# Altium project LimeNet-Micro_2v1-SDR.PrjPcb (part 9 of 10)
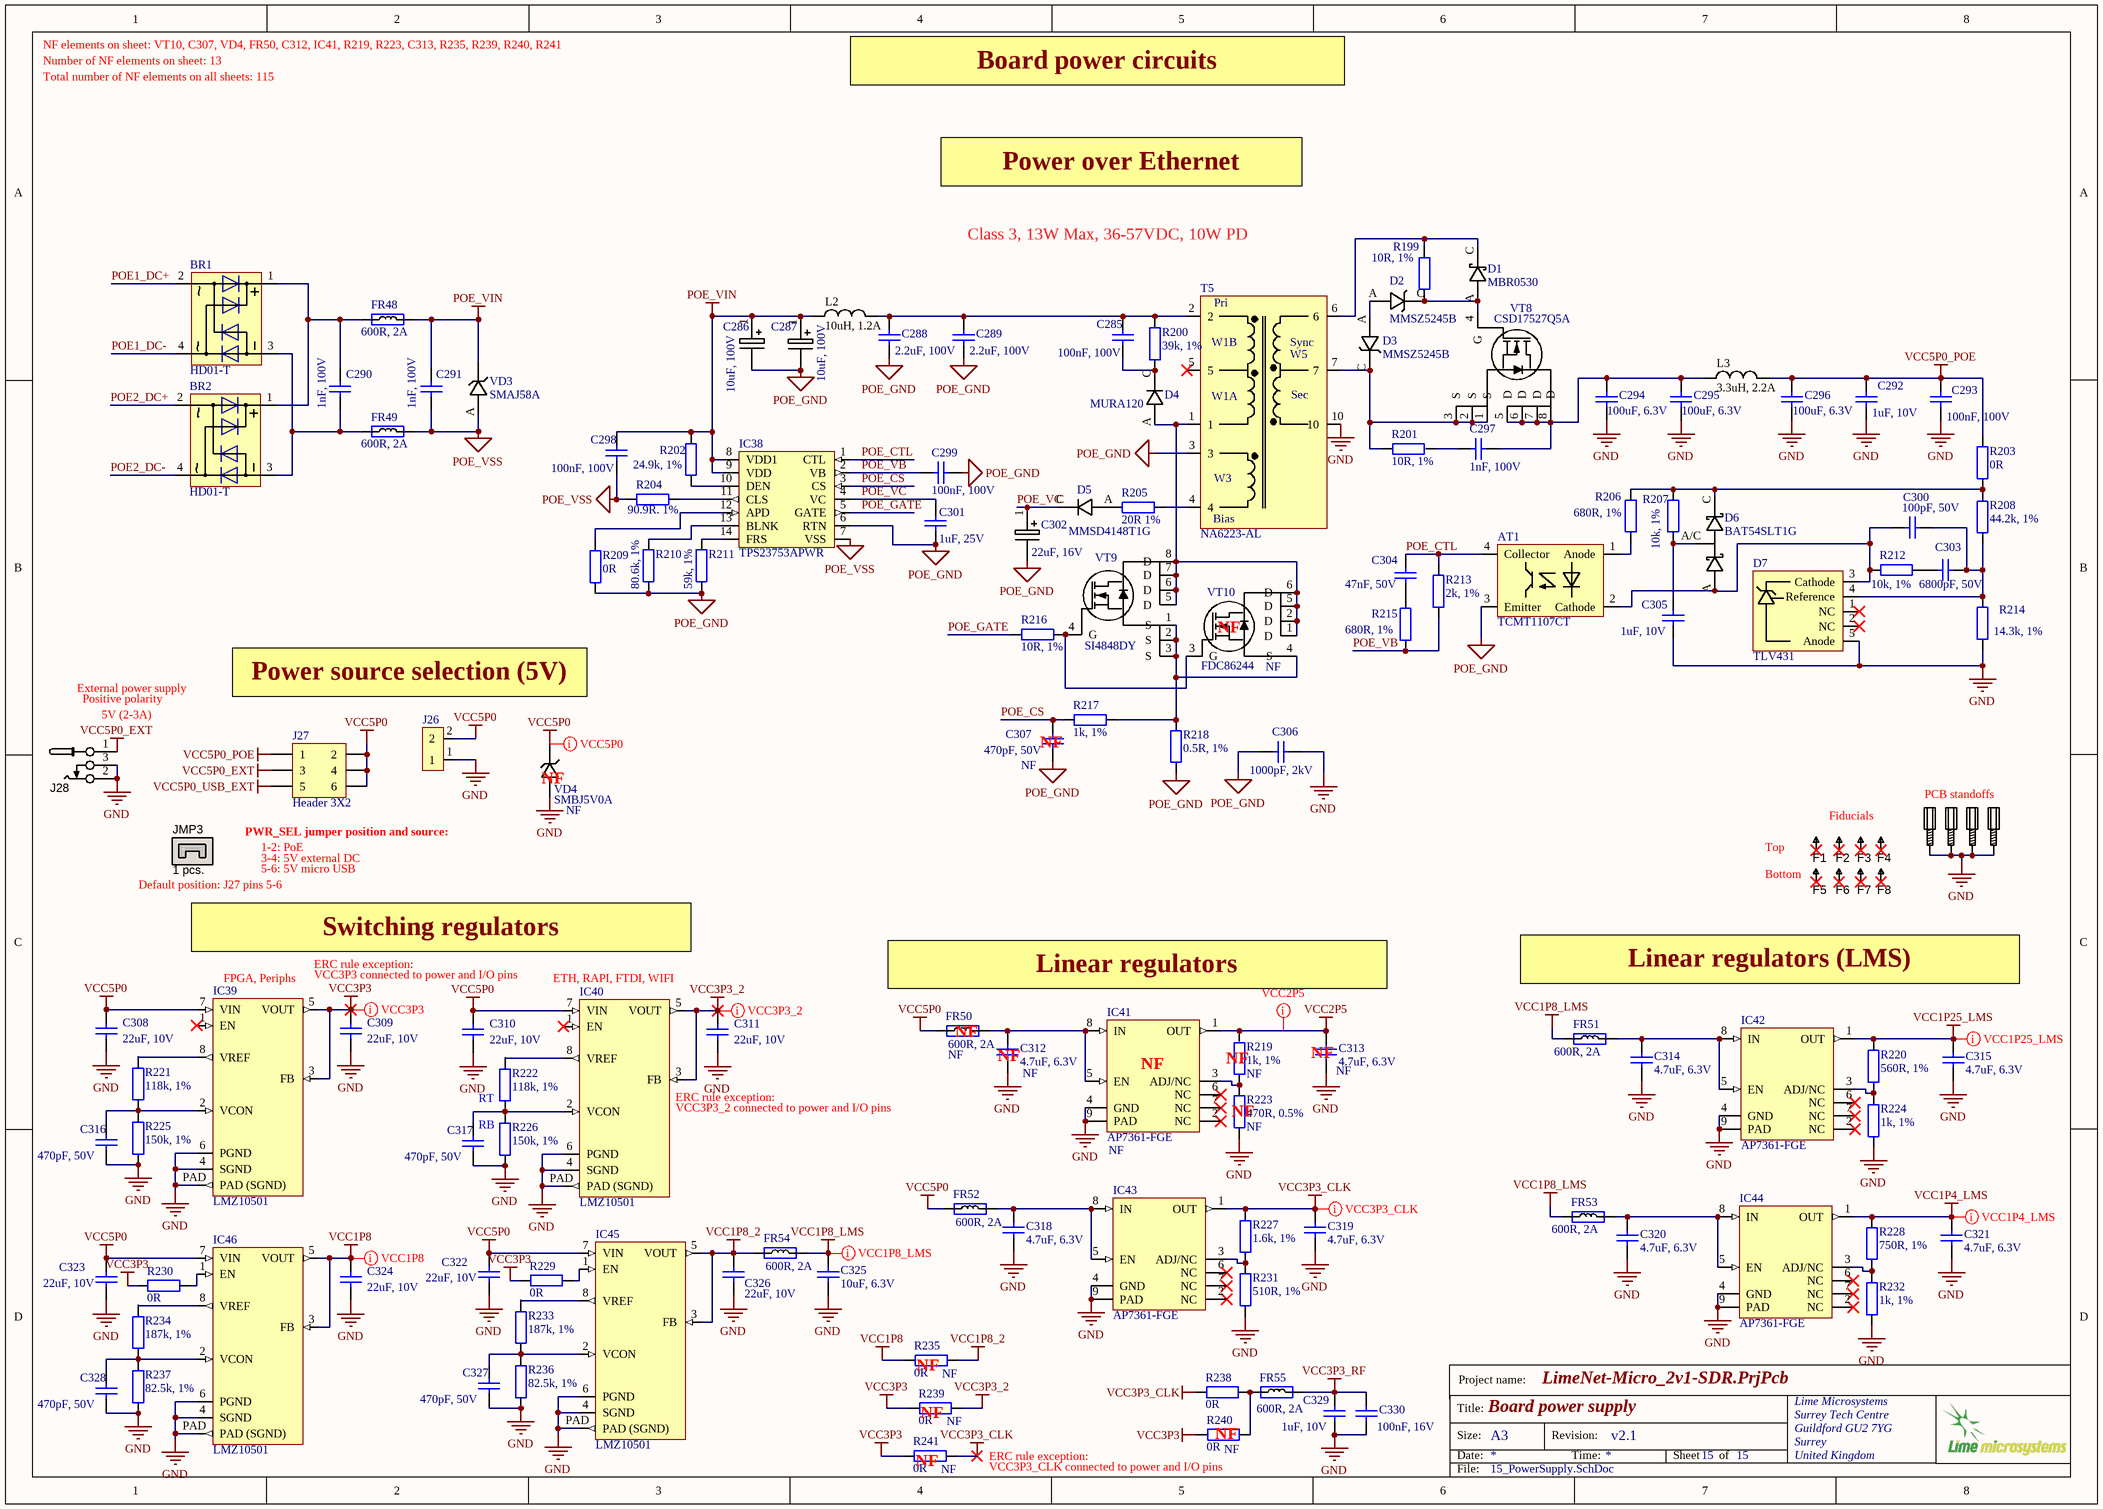
[diagram p16: 15_PowerSupply.SchDoc]

## Sheet 15_PowerSupply.SchDoc: Board power supply (continued)

### Library data of the parts (continued)
L3 = Inductor_0603: Part Description: 3.3µH Semi-Shielded Wirewound Inductor 2.2A 66 mOhm Max Nonstandard; Manufacturer: Bourns; Manufacturer Part Number 1: SRN4018-3R3M; Core Material: Ferrite; Material: Steel; Tolerance: 20%; Saturation Current: 2.3A; Shielding: Shielded; DC Resistance (DCR): 66mR; Self Resonant Frequency: 45MHz; Test Frequency: 100kHz; Value: 3.3uH, 2.2A; ComponentLink1URL: https://www.yuden.co.jp/productdata/catalog/en/wound04_e.pdf; ComponentLink1Description: https://www.yuden.co.jp/productdata/catalog/en/wound04_e.pdf; ComponentLink2URL: http://uk.rs-online.com/webdocs/10b3/0900766b810b3cd2.pdf; ComponentLink2Description: http://uk.rs-online.com/webdocs/10b3/0900766b810b3cd2.pdf; Supplier 1: Digi-Key; Supplier Part Number 1: SRN4018-3R3MCT-ND; Stock 1: 14181; Pricing 1: 1=0.46, 10=0.403, 100=0.2875, 500=0.2415, 1000=0.1955 (USD); Mount: Surface Mount; Case/Package: Nonstandard; Number of Pins: 2; Min Operating Temperature: -25°C; Max Operating Temperature: 120°C; Packaging: Cut Tape; Package Quantity: 3000; Current Rating: 2.2A; Inductance: 3.3uh; Inductance Tolerance: 20%; Composition: Wirewound; Max DC Current: 2.2A; Termination: SMD/SMT; DC Current: 2.2A; Military Standard: Not; RMS Current (Irms): 2.2A; Length: 4mm; Height: 1.8mm; Width: 4mm; Height - Seated (Max): 0.071inch; Depth: 4.2mm; REACH SVHC: No SVHC; ComponentLink3URL: http://www.bourns.com/docs/Product-Datasheets/SRN4018.pdf; ComponentLink3Description: http://www.bourns.com/docs/Product-Datasheets/SRN4018.pdf; ComponentLink4URL: http://www.farnell.com/datasheets/1684089.pdf; ComponentLink4Description: http://www.farnell.com/datasheets/1684089.pdf; ComponentLink5URL: https://www.bourns.com/docs/Product-Datasheets/SRN4018.pdf; ComponentLink5Description: https://www.bourns.com/docs/Product-Datasheets/SRN4018.pdf; ComponentLink6URL: http://www.mouser.com/ds/2/54/rn4018-778397.pdf; ComponentLink6Description: http://www.mouser.com/ds/2/54/rn4018-778397.pdf; ComponentLink7URL: https://www.alliedelec.com/m/d/dd1c9725060a5800d35900a7fd6620e8.pdf; ComponentLink7Description: https://www.alliedelec.com/m/d/dd1c9725060a5800d35900a7fd6620e8.pdf; ComponentLink8URL: http://www.produktinfo.conrad.com/datenblaetter/1000000-1099999/001056425-da-01-en-MAG_ABG_LEIST_IND_SRN4018_3R3M_3_3UH_SMD.pdf; ComponentLink8Description: http://www.produktinfo.conrad.com/datenblaetter/1000000-1099999/001056425-da-01-en-MAG_ABG_LEIST_IND_SRN4018_3R3M_3_3UH_SMD.pdf
MECH5-MECH8 = STANDOFF_M-F_THREADED_M3x8x10mm_HEX_5mm dia: STANDOFF M/F MET 5MM HEX 10MM L; Manufacturer: FIX&FASTEN; Manufacturer Part Number 1: FIX-MAE-5TV; Part Description: PCB distance; polyamide; L:5mm; Colour: natural; Øcutout:3mm; Unit: pcs; SuppliedAmount: 1000; MinAmount: 10; Type of spacer: PCB distance; Panel cutout diameter: 3mm; Spanner size: 5.5mm; Internal thread: M3; Thread pitch: 0,5; Supplier 1: TME; Supplier Part Number 1: FIX-MAE-5TV; Category: Plastic Pegs; Weight: 0.145; Multiples: 10; Material: polyamide; Spacer length: 5mm; Price Type: NET
R199 R216 = Res_0603: Manufacturer: Vishay; Manufacturer Part Number 1: CRCW060310R0FKEAC; Part Description: 10 Ohms ±1% 0.1W, 1/10W Chip Resistor 0603 (1608 Metric)  Thick Film; Power Rating: 100mW; Value: 10R, 1%; Supplier 1: Digi-Key; Supplier Part Number 1: 541-3952-1-ND; Stock 1: 763669; Pricing 1: 1=0.1, 10=0.03, 100=0.0123, 1000=0.00554, 2500=0.00481 (USD); Case/Package: 0603; Resistance: 10R; Tolerance: 1%; Lead Free: Lead Free
R200 = Res_0402: Manufacturer: Yageo; Manufacturer Part Number 1: RC0805FR-0739KL; Part Description: 39 kOhms ±1% 0.125W, 1/8W Chip Resistor 0805 (2012 Metric) Moisture Resistant Thick Film; Resistance: 39kR; Power Rating: 125mW; Temperature Coefficient: 100ppm/°C; Voltage Rating: 150V; Value: 39k, 1%; ComponentLink1URL: http://www.yageo.com/documents/recent/PYu-RC_Group_51_RoHS_L_10.pdf; ComponentLink1Description: http://www.yageo.com/documents/recent/PYu-RC_Group_51_RoHS_L_10.pdf; ComponentLink2URL: http://www.yageo.com/documents/recent/PYu-RC_Group_51_RoHS_L_9.pdf; ComponentLink2Description: http://www.yageo.com/documents/recent/PYu-RC_Group_51_RoHS_L_9.pdf; ComponentLink3URL: http://www.yageo.com/documents/recent/PYu-RC0402_51_RoHS_L_6_r.pdf; ComponentLink3Description: http://www.yageo.com/documents/recent/PYu-RC0402_51_RoHS_L_6_r.pdf; ComponentLink4URL: http://www.mouser.com/ds/2/447/PYu-RC0402_51_RoHS_L_6_r-8721.pdf; ComponentLink4Description: http://www.mouser.com/ds/2/447/PYu-RC0402_51_RoHS_L_6_r-8721.pdf; ComponentLink5URL: http://www.farnell.com/datasheets/1018594.pdf; ComponentLink5Description: http://www.farnell.com/datasheets/1018594.pdf; Supplier 1: Digi-Key; Supplier Part Number 1: 311-39.0KCRCT-ND; Stock 1: 525363; Pricing 1: 1=0.1, 10=0.042, 100=0.017, 1000=0.00762, 2500=0.00662 (USD); Case/Package: 0805; Weight: 0.000194oz; Case Code (Imperial): 0805; Case Code (Metric): 2012; Min Operating Temperature: -55°C; Max Operating Temperature: 155°C; Tolerance: 1%; Packaging: Tape and Reel; Termination: SMD/SMT; Composition: Thick Film; Military Standard: Not; Package Quantity: 1; Number of Terminations: 2; Max Power Dissipation: 125mW; Features: Moisture Resistant; Working Voltage: 150V; Length: 2mm; Height: 0.5mm; Depth: 1.25mm; Width: 1.25mm; REACH SVHC: Unknown; Lead Free: Lead Free; ComponentLink6URL: https://www.verical.com/server-webapp/html/getDatasheet?partID=344453; ComponentLink6Description: https://www.verical.com/server-webapp/html/getDatasheet?partID=344453; ComponentLink7URL: http://documents.rs-components.com/techlib://itc_doclist_GB.htm?stockno=6183331; ComponentLink7Description: http://documents.rs-components.com/techlib://itc_doclist_GB.htm?stockno=6183331
R201 = Res_0402: Manufacturer: Vishay; Manufacturer Part Number 1: CRCW080510R0FKEAC; Part Description: 10 Ohms ±1% 0.125W, 1/8W Chip Resistor 0805 (2012 Metric)  Thick Film; Power Rating: 125mW; Temperature Coefficient: 100ppm/°C; Value: 10R, 1%; Supplier 1: Digi-Key; Supplier Part Number 1: 541-4132-1-ND; Stock 1: 434349; Pricing 1: 1=0.1, 10=0.048, 100=0.0195, 1000=0.00875, 2500=0.00759 (USD); Mount: Surface Mount; Case/Package: Molded; Contact Plating: Tin; Min Operating Temperature: -55°C; Max Operating Temperature: 155°C; Resistance: 10R; Tolerance: 1%; Composition: Thick Film; Termination: Wraparound; Length: 2mm; Lead Free: Lead Free
R202 = Res_0402: Manufacturer: Yageo; Manufacturer Part Number 1: RC0402FR-0724K9L; Part Description: 24.9 kOhms ±1% 0.063W, 1/16W Chip Resistor 0402 (1005 Metric) Moisture Resistant Thick Film; Resistance: 24.9kR; Power Rating: 62.5mW; Voltage Rating: 50V; Max Power Dissipation: 63mW; Temperature Coefficient: 100ppm/°C; Value: 24.9k, 1%; Supplier 1: Digi-Key; Supplier Part Number 1: 311-24.9KLRCT-ND; Stock 1: 9706655; Pricing 1: 1=0.1, 10=0.016, 100=0.0067, 1000=0.00301, 2500=0.00261, 5000=0.00215 (USD); Case/Package: 0402; Case Code (Metric): 1005; Case Code (Imperial): 0402; Contact Plating: Matte,Tin; Min Operating Temperature: -55°C; Max Operating Temperature: 155°C; Tolerance: 1%; Package Quantity: 1; Packaging: Tape and Reel; Composition: Thick Film; Number of Terminations: 2; Termination: SMD/SMT; Military Standard: Not; Voltage Rating (DC): 50V; Features: Moisture Resistant; Length: 1mm; Height: 0.016inch; Width: 0.02inch; Depth: 0.5mm; Lead Free: Lead Free; ComponentLink1URL: http://www.yageo.com/documents/recent/PYu-RC_Group_51_RoHS_L_9.pdf; ComponentLink1Description: http://www.yageo.com/documents/recent/PYu-RC_Group_51_RoHS_L_9.pdf; ComponentLink2URL: http://www.yageo.com/documents/recent/PYu-RC_Group_51_RoHS_L_10.pdf; ComponentLink2Description: http://www.yageo.com/documents/recent/PYu-RC_Group_51_RoHS_L_10.pdf; ComponentLink3URL: http://www.mouser.com/ds/2/447/PYu-RC0402_51_RoHS_L_6_r-8721.pdf; ComponentLink3Description: http://www.mouser.com/ds/2/447/PYu-RC0402_51_RoHS_L_6_r-8721.pdf; ComponentLink4URL: http://www.yageo.com/documents/recent/PYu-RC0402_51_RoHS_L_6.pdf; ComponentLink4Description: http://www.yageo.com/documents/recent/PYu-RC0402_51_RoHS_L_6.pdf; ComponentLink5URL: http://www.yageo.com/documents/recent/PYu-RC0402_51_RoHS_L_6_r.pdf; ComponentLink5Description: http://www.yageo.com/documents/recent/PYu-RC0402_51_RoHS_L_6_r.pdf
R203 R209 = Res_0402: Manufacturer: Yageo; Part Description: RES SMD 0.0OHM JUMPER 1/16W 0402; Manufacturer Part Number 1: RC0402JR-070RL; Power (Watts): 0.063W, 1/16W; Resistance (Ohms): 0.0; Tolerance: Jumper; Supplier 1: Digi-Key; Supplier Part Number 1: 311-0.0JRTR-ND; Composition: Thick Film; Package / Case: 0402 (1005 Metric); Category: Resistors; Value: 0R; Features: Moisture Resistant; Height: 0.016" (0.40mm); Number of Terminations: 2; Operating Temperature: -55°C ~ 155°C; Packaging: Tape & Reel (TR); RoHS: RoHS Compliant; Size / Dimension: 0.039" L x 0.020" W (1.00mm x 0.50mm); Supplier Device Package: 0402; Temperature Coefficient: -
R204 = Res_0603: Manufacturer: Yageo; Manufacturer Part Number 1: RC0603FR-0790R9L; Part Description: 90.9 Ohms ±1% 0.1W, 1/10W Chip Resistor 0603 (1608 Metric) Moisture Resistant Thick Film; Voltage Rating (DC): 50V; Resistance: 90.9R; Power Rating: 100mW; Temperature Coefficient: 100ppm/°C; Value: 90.9R. 1%; Supplier 1: Digi-Key; Supplier Part Number 1: 311-90.9HRCT-ND; Stock 1: 499655; Pricing 1: 1=0.1, 10=0.024, 100=0.0097, 1000=0.00437, 2500=0.00379 (USD); Case/Package: 0603; Case Code (Imperial): 0603; Case Code (Metric): 1608; Min Operating Temperature: -55°C; Max Operating Temperature: 155°C; Tolerance: 1%; Packaging: Tape and Reel; Package Quantity: 5000; Voltage Rating: 50V; Termination: SMD/SMT; Composition: Thick Film; Military Standard: Not; Length: 1.6mm; Height: 0.45mm; Width: 0.8mm; Depth: 0.8mm; Lead Free: Lead Free; ComponentLink1URL: https://www.verical.com/server-webapp/html/getDatasheet?partID=326528; ComponentLink1Description: https://www.verical.com/server-webapp/html/getDatasheet?partID=326528; ComponentLink2URL: http://www.mouser.com/ds/2/447/RC0603-1212058.pdf; ComponentLink2Description: http://www.mouser.com/ds/2/447/RC0603-1212058.pdf
R205 = Res_0402: Manufacturer: Yageo; Manufacturer Part Number 1: RC0805FR-0720RL; Part Description: 20 Ohms ±1% 0.125W, 1/8W Chip Resistor 0805 (2012 Metric) Moisture Resistant Thick Film; Temperature Coefficient: 100ppm/°C; Voltage Rating (DC): 150V; Power Rating: 125mW; Value: 20R 1%; Supplier 1: Digi-Key; Supplier Part Number 1: 311-20.0CRCT-ND; Stock 1: 1143653; Pricing 1: 1=0.1, 10=0.042, 100=0.017, 1000=0.00762, 2500=0.00662 (USD); Mount: Surface Mount; Case/Package: 0805; Weight: 0.000194oz; Case Code (Metric): 2012; Case Code (Imperial): 0805; Min Operating Temperature: -55°C; Max Operating Temperature: 155°C; Tolerance: 1%; Resistance: 20R; Packaging: Tape and Reel; Composition: Thick Film; Voltage Rating: 150V; Number of Terminations: 2; Termination: SMD/SMT; Package Quantity: 1; Max Power Dissipation: 125mW; Working Voltage: 150V; Features: Moisture Resistant; Length: 2mm; Height: 0.5mm; Width: 0.049inch; Depth: 1.25mm; Lead Free: Lead Free; ComponentLink1URL: http://www.yageo.ru/pdf/RC0805.pdf; ComponentLink1Description: http://www.yageo.ru/pdf/RC0805.pdf; ComponentLink2URL: http://www.yageo.com/documents/recent/PYu-RC_Group_51_RoHS_L_9.pdf; ComponentLink2Description: http://www.yageo.com/documents/recent/PYu-RC_Group_51_RoHS_L_9.pdf; ComponentLink3URL: http://www.mouser.com/ds/2/447/Yageo_08112016_RC0805-968729.pdf; ComponentLink3Description: http://www.mouser.com/ds/2/447/Yageo_08112016_RC0805-968729.pdf; ComponentLink4URL: http://www.yageo.com.tw/exep/pages/download/literatures/PYu-R_INT-thick_7.pdf; ComponentLink4Description: http://www.yageo.com.tw/exep/pages/download/literatures/PYu-R_INT-thick_7.pdf
R206 R215 = Res_0402: Manufacturer: Yageo; Manufacturer Part Number 1: RC0402FR-07680RL; Part Description: 680 Ohms ±1% 0.063W, 1/16W Chip Resistor 0402 (1005 Metric) Moisture Resistant Thick Film; Temperature Coefficient: 100ppm/°C; Power Rating: 63mW; Voltage Rating: 50V; Value: 680R, 1%; Supplier 1: Digi-Key; Supplier Part Number 1: 311-680LRCT-ND; Stock 1: 1817297; Pricing 1: 1=0.1, 10=0.016, 100=0.0067, 1000=0.00301, 2500=0.00261, 5000=0.00215 (USD); Case/Package: 0402; Case Code (Imperial): 0402; Case Code (Metric): 1005; Min Operating Temperature: -55°C; Max Operating Temperature: 155°C; Tolerance: 1%; Packaging: Tape and Reel; Resistance: 680R; Composition: Thick Film; Termination: SMD/SMT; Military Standard: Not; Length: 1mm; Depth: 0.5mm; Lead Free: Lead Free; REACH SVHC: No SVHC; ComponentLink1URL: http://www.farnell.com/datasheets/1018594.pdf; ComponentLink1Description: http://www.farnell.com/datasheets/1018594.pdf; ComponentLink2URL: http://www.mouser.com/ds/2/447/PYu-RC0402_51_RoHS_L_6_r-8721.pdf; ComponentLink2Description: http://www.mouser.com/ds/2/447/PYu-RC0402_51_RoHS_L_6_r-8721.pdf; ComponentLink3URL: http://www.yageo.com/documents/recent/PYu-RC0402_51_RoHS_L_6_r.pdf; ComponentLink3Description: http://www.yageo.com/documents/recent/PYu-RC0402_51_RoHS_L_6_r.pdf
R207 R212 = Res_0402: Manufacturer: Yageo; Manufacturer Part Number 1: RC0402FR-0710KL; Part Description: RES SMD 10K OHM 1% 1/16W 0402; Temperature Coefficient: ±100ppm/°C; Power (Watts): 0.063W, 1/16W; Value: 10k, 1%; Supplier 1: Digi-Key; Supplier Part Number 1: 311-10.0KLRTR-ND; Resistance (Ohms): 10k; Packaging: Tape & Reel (TR); RoHS: RoHS Compliant; Package / Case: 0402 (1005 Metric); Tolerance: ±1%; Operating Temperature: -55°C ~ 155°C; Size / Dimension: 0.039" L x 0.020" W (1.00mm x 0.50mm); Number of Terminations: 2; Category: Resistors; Height: 0.016" (0.40mm); Supplier Device Package: 0402; Features: Moisture Resistant; Composition: Thick Film
R208 = Res_0402: Manufacturer Part Number 1: ERJ-2RKF4422X; Manufacturer: Panasonic Electronic Components; Part Description: RES SMD 44.2K OHM 1% 1/10W 0402; Power (Watts): 0.1W, 1/10W; Temperature Coefficient: ±100ppm/°C; Value: 44.2k, 1%; Supplier 1: Digi-Key; Supplier Part Number 1: P44.2KLCT-ND; Tolerance: ±1%; Supplier Device Package: 0402; Packaging: Cut Tape (CT); Size / Dimension: 0.039" L x 0.020" W (1.00mm x 0.50mm); Features: Automotive AEC-Q200; Package / Case: 0402 (1005 Metric); Height: 0.016" (0.40mm); Operating Temperature: -55°C ~ 155°C; Number of Terminations: 2; Composition: Thick Film; Resistance (Ohms): 44.2k; RoHS: RoHS Compliant; Category: Resistors
R210 = Res_0402: Manufacturer: Yageo; Manufacturer Part Number 1: RC0402FR-0780K6L; Part Description: 80.6 kOhms ±1% 0.063W, 1/16W Chip Resistor 0402 (1005 Metric) Moisture Resistant Thick Film; Resistance: 80.6kR; Voltage Rating (DC): 50V; Power Rating: 62.5mW; Temperature Coefficient: 100ppm/°C; Value: 80.6k, 1%; Supplier 1: Digi-Key; Supplier Part Number 1: 311-80.6KLRCT-ND; Stock 1: 1204034; Pricing 1: 1=0.1, 10=0.016, 100=0.0067, 1000=0.00301, 2500=0.00261, 5000=0.00215 (USD); Case/Package: 0402; Case Code (Imperial): 0402; Case Code (Metric): 1005; Contact Plating: Matte,Tin; Min Operating Temperature: -55°C; Max Operating Temperature: 155°C; Tolerance: 1%; Packaging: Tape and Reel; Voltage Rating: 50V; Termination: SMD/SMT; Composition: Thick Film; Military Standard: Not; Working Voltage: 50V; Number of Terminations: 2; Length: 1mm; Depth: 0.5mm; Lead Free: Lead Free; ComponentLink1URL: http://www.yageo.com/documents/recent/PYu-RC0402_51_RoHS_L_6.pdf; ComponentLink1Description: http://www.yageo.com/documents/recent/PYu-RC0402_51_RoHS_L_6.pdf; ComponentLink2URL: https://www.verical.com/server-webapp/html/getDatasheet?partID=29250; ComponentLink2Description: https://www.verical.com/server-webapp/html/getDatasheet?partID=29250
R211 = Res_0402: Manufacturer: Yageo; Manufacturer Part Number 1: RC0402FR-0759KL; Part Description: 59 kOhms ±1% 0.063W, 1/16W Chip Resistor 0402 (1005 Metric) Moisture Resistant Thick Film; Resistance: 59kR; Power Rating: 62.5mW; Voltage Rating: 50V; Max Power Dissipation: 63mW; Temperature Coefficient: 100ppm/°C; Value: 59k, 1%; Supplier 1: Digi-Key; Supplier Part Number 1: 311-59KLRCT-ND; Stock 1: 1248616; Pricing 1: 1=0.1, 10=0.016, 100=0.0067, 1000=0.00301, 2500=0.00261, 5000=0.00215 (USD); Case/Package: 0402; Case Code (Metric): 1005; Case Code (Imperial): 0402; Contact Plating: Matte,Tin; Min Operating Temperature: -55°C; Max Operating Temperature: 155°C; Package Quantity: 1; Tolerance: 1%; Packaging: Tape and Reel; Composition: Thick Film; Number of Terminations: 2; Termination: SMD/SMT; Military Standard: Not; Voltage Rating (DC): 50V; Features: Moisture Resistant; Length: 1mm; Height: 0.016inch; Width: 0.02inch; Depth: 0.5mm; Lead Free: Lead Free; ComponentLink1URL: http://www.yageo.com/documents/recent/PYu-RC_Group_51_RoHS_L_9.pdf; ComponentLink1Description: http://www.yageo.com/documents/recent/PYu-RC_Group_51_RoHS_L_9.pdf; ComponentLink2URL: http://www.yageo.com/documents/recent/PYu-RC_Group_51_RoHS_L_10.pdf; ComponentLink2Description: http://www.yageo.com/documents/recent/PYu-RC_Group_51_RoHS_L_10.pdf; ComponentLink3URL: http://www.yageo.com.tw/exep/pages/download/literatures/PYu-R_INT-thick_7.pdf; ComponentLink3Description: http://www.yageo.com.tw/exep/pages/download/literatures/PYu-R_INT-thick_7.pdf; ComponentLink4URL: http://www.yageo.com/documents/recent/PYu-RC0402_51_RoHS_L_6.pdf; ComponentLink4Description: http://www.yageo.com/documents/recent/PYu-RC0402_51_RoHS_L_6.pdf
R213 = Res_0402: Manufacturer: Yageo; Manufacturer Part Number 1: RC0402FR-072KL; Part Description: 2 kOhms ±1% 0.063W, 1/16W Chip Resistor 0402 (1005 Metric) Moisture Resistant Thick Film; Resistance: 2kR; Power Rating: 63mW; Voltage Rating: 50V; Temperature Coefficient: 100ppm/°C; Value: 2k, 1%; Supplier 1: Digi-Key; Supplier Part Number 1: 311-2KLRCT-ND; Stock 1: 14304011; Pricing 1: 1=0.1, 10=0.016, 100=0.0067, 1000=0.00301, 2500=0.00261, 5000=0.00215 (USD); Case/Package: 0402; Case Code (Metric): 1005; Case Code (Imperial): 0402; Min Operating Temperature: -55°C; Max Operating Temperature: 155°C; Tolerance: 1%; Package Quantity: 1; Packaging: Tape and Reel; Composition: Thick Film; Number of Terminations: 2; Termination: SMD/SMT; Military Standard: Not; Max Power Dissipation: 63mW; Voltage Rating (DC): 50V; Working Voltage: 50V; Features: Moisture Resistant; Length: 1mm; Height: 0.016inch; Width: 0.02inch; Depth: 0.5mm; REACH SVHC: Unknown; Lead Free: Lead Free; ComponentLink1URL: http://www.yageo.com/documents/recent/PYu-RC_Group_51_RoHS_L_10.pdf; ComponentLink1Description: http://www.yageo.com/documents/recent/PYu-RC_Group_51_RoHS_L_10.pdf; ComponentLink2URL: http://documents.rs-components.com/techlib://itc_doclist_GB.htm?stockno=6186510; ComponentLink2Description: http://documents.rs-components.com/techlib://itc_doclist_GB.htm?stockno=6186510; ComponentLink3URL: https://www.verical.com/server-webapp/html/getDatasheet?partID=358921; ComponentLink3Description: https://www.verical.com/server-webapp/html/getDatasheet?partID=358921; ComponentLink4URL: http://www.mouser.com/ds/2/447/PYu-RC0402_51_RoHS_L_6_r-8721.pdf; ComponentLink4Description: http://www.mouser.com/ds/2/447/PYu-RC0402_51_RoHS_L_6_r-8721.pdf; ComponentLink5URL: http://www.farnell.com/datasheets/1018594.pdf; ComponentLink5Description: http://www.farnell.com/datasheets/1018594.pdf; ComponentLink6URL: http://www.farnell.com/datasheets/2167052.pdf; ComponentLink6Description: http://www.farnell.com/datasheets/2167052.pdf
R214 = Res_0402: Manufacturer: Yageo; Manufacturer Part Number 1: RC0402FR-0714K3L; Part Description: 14.3 kOhms ±1% 0.063W, 1/16W Chip Resistor 0402 (1005 Metric) Moisture Resistant Thick Film; Resistance: 14.3kR; Power Rating: 62.5mW; Voltage Rating: 50V; Temperature Coefficient: 100ppm/°C; Max Power Dissipation: 63mW; Value: 14.3k, 1%; Supplier 1: Digi-Key; Supplier Part Number 1: YAG2983CT-ND; Stock 1: 463049; Pricing 1: 1=0.1, 10=0.016, 100=0.0067, 1000=0.00301, 2500=0.00261, 5000=0.00215 (USD); Case/Package: 0402; Case Code (Imperial): 0402; Case Code (Metric): 1005; Contact Plating: Matte,Tin; Min Operating Temperature: -55°C; Max Operating Temperature: 155°C; Tolerance: 1%; Packaging: Tape and Reel; Composition: Thick Film; Termination: SMD/SMT; Number of Terminations: 2; Military Standard: Not; Voltage Rating (DC): 50V; Working Voltage: 50V; Features: Moisture Resistant; Length: 1mm; Height: 0.016inch; Width: 0.5mm; Depth: 0.5mm; Radiation Hardening: No; Lead Free: Lead Free; ComponentLink1URL: http://www.yageo.com/documents/recent/PYu-RC0402_51_RoHS_L_6.pdf; ComponentLink1Description: http://www.yageo.com/documents/recent/PYu-RC0402_51_RoHS_L_6.pdf; ComponentLink2URL: http://www.yageo.com/documents/recent/PYu-RC0402_51_RoHS_L_6_r.pdf; ComponentLink2Description: http://www.yageo.com/documents/recent/PYu-RC0402_51_RoHS_L_6_r.pdf
R217 R219 R224 R232 = Res_0402: Manufacturer: Stackpole Electronics Inc; Manufacturer Part Number 1: RMCF0402FT1K00; Part Description: RES SMD 1K OHM 1% 1/16W 0402; Temperature Coefficient: ±100ppm/°C; Power (Watts): 0.063W, 1/16W; Value: 1k, 1%; Supplier 1: Digi-Key; Supplier Part Number 1: RMCF0402FT1K00TR-ND; Resistance (Ohms): 1k; Packaging: Tape & Reel (TR); Category: Resistors; RoHS: RoHS Compliant; Tolerance: ±1%; Height: 0.016" (0.40mm); Number of Terminations: 2; Package / Case: 0402 (1005 Metric); Operating Temperature: -55°C ~ 155°C; Features: -; Composition: Thick Film; Supplier Device Package: 0402; Size / Dimension: 0.039" L x 0.020" W (1.00mm x 0.50mm)
R218 = Res_0402: Manufacturer: Yageo; Manufacturer Part Number 1: RL1206FR-070R5L; Part Description: 500 mOhms ±1% 0.25W, 1/4W Chip Resistor 1206 (3216 Metric) Automotive AEC-Q200, Current Sense, Moisture Resistant Thick Film; Resistance: 500mR; Power Rating: 250mW; Temperature Coefficient: 300ppm/°C; Value: 0.5R, 1%; Supplier 1: Digi-Key; Supplier Part Number 1: 311-0.5LWCT-ND; Stock 1: 131614; Pricing 1: 1=0.42, 10=0.299, 100=0.1195, 1000=0.05891, 2500=0.05457 (USD); Case/Package: 1206; Case Code (Imperial): 1206; Case Code (Metric): 3216; Contact Plating: Matte,Tin; Min Operating Temperature: -55°C; Max Operating Temperature: 125°C; Tolerance: 1%; Packaging: Tape and Reel; Termination: SMD/SMT; Composition: Thick Film; Military Standard: Not; Length: 3.1mm; Height: 0.55mm; Width: 1.6mm; Depth: 1.6mm; Radiation Hardening: No; Lead Free: Lead Free; ComponentLink1URL: http://www.yageo.com/documents/recent/PYu-RL_521_RoHS_L_5.pdf; ComponentLink1Description: http://www.yageo.com/documents/recent/PYu-RL_521_RoHS_L_5.pdf; ComponentLink2URL: http://www.mouser.com/ds/2/447/PYu-RL_521_RoHS_L_5-2927.pdf; ComponentLink2Description: http://www.mouser.com/ds/2/447/PYu-RL_521_RoHS_L_5-2927.pdf
R220 = Res_0402: Manufacturer Part Number 1: CRCW0402560RFKED; Manufacturer: Vishay Dale; Part Description: RES SMD 560 OHM 1% 1/16W 0402; Resistance (Ohms): 560; Power (Watts): 0.063W, 1/16W; Temperature Coefficient: ±100ppm/°C; RoHS: RoHS Compliant; Packaging: Cut Tape (CT); Composition: Thick Film; Tolerance: ±1%; Number of Terminations: 2; Supplier Device Package: 0402 (1005 Metric); Operating Temperature: -55°C ~ 155°C; Features: Automotive AEC-Q200; Category: Resistors; Supplier Part Number 1: 541-560LCT-ND; Package / Case: 0402 (1005 Metric); Supplier 1: Digi-Key; Height: 0.016" (0.40mm); Size / Dimension: 0.039" L x 0.020" W (1.00mm x 0.50mm)
R221 R222 = Res_0402: Manufacturer: Yageo; Manufacturer Part Number 1: RC0402FR-07118KL; Part Description: 118 kOhms ±1% 0.063W, 1/16W Chip Resistor 0402 (1005 Metric) Moisture Resistant Thick Film; Temperature Coefficient: ±100ppm/°C; Power (Watts): 0.063W, 1/16W; Value: 118k, 1%; Package / Case: 0402 (1005 Metric); Packaging: Cut Tape (CT); Supplier Device Package: 0402; Features: Moisture Resistant; Part Status: Active; Failure Rate: -; Composition: Thick Film; Operating Temperature: -55°C ~ 155°C; Category: Resistors; Tolerance: ±1%; Supplier Part Number 1: YAG2369CT-ND; Supplier 1: Digi-Key; Size / Dimension: 0.039" L x 0.020" W (1.00mm x 0.50mm); RoHS: RoHS Compliant; Height - Seated (Max): 0.016" (0.40mm)
R223 = Res_0402: Manufacturer: Panasonic Electronic Components; Manufacturer Part Number 1: ERA-2AED471X; Power (Watts): 0.063W, 1/16W; Temperature Coefficient: ±25ppm/°C; Resistance (Ohms): 470; Value: 470R, 0.5%; Supplier 1: Digi-Key; Supplier Part Number 1: P470DETR-ND; Tolerance: ±0.5%; Packaging: Tape & Reel (TR); Number of Terminations: 2; Operating Temperature: -55°C ~ 155°C; RoHS: RoHS Compliant; Size / Dimension: 0.039" L x 0.020" W (1.00mm x 0.50mm); Composition: Thin Film; Package / Case: 0402 (1005 Metric); Height: 0.016" (0.40mm); Features: Automotive AEC-Q200; Supplier Device Package: 0402; Category: Resistors
R225 R226 = Res_0402: Manufacturer: Yageo; Manufacturer Part Number 1: RC0402JR-07150KL; Part Description: 150 kOhms ±5% 0.063W, 1/16W Chip Resistor 0402 (1005 Metric) Moisture Resistant Thick Film; Power (Watts): 0.063W, 1/16W; Tolerance: ±5%; Temperature Coefficient: ±100ppm/°C; Value: 150k, 1%; Operating Temperature: -55°C ~ 155°C; Composition: Thick Film; Category: Resistors; Height - Seated (Max): 0.016" (0.40mm); Failure Rate: -; Features: Moisture Resistant; Part Status: Active; Package / Case: 0402 (1005 Metric); Size / Dimension: 0.039" L x 0.020" W (1.00mm x 0.50mm); Packaging: Cut Tape (CT); Supplier 1: Digi-Key; Supplier Device Package: 0402; Supplier Part Number 1: 311-150KJRCT-ND; RoHS: RoHS Compliant
R227 = Res_0402: Manufacturer Part Number 1: RC0402FR-071K6L; Manufacturer: Yageo; Part Description: 1.6 kOhms ±1% 0.063W, 1/16W Chip Resistor 0402 (1005 Metric) Moisture Resistant Thick Film; Temperature Coefficient: ±100ppm/°C; Power (Watts): 0.063W, 1/16W; Value: 1.6k, 1%; Tolerance: ±1%; RoHS: RoHS Compliant; Package / Case: 0402 (1005 Metric); Height - Seated (Max): 0.016" (0.40mm); Supplier Device Package: 0402; Failure Rate: -; Composition: Thick Film; Part Status: Active; Size / Dimension: 0.039" L x 0.020" W (1.00mm x 0.50mm); Operating Temperature: -55°C ~ 155°C; Packaging: Cut Tape (CT); Features: Moisture Resistant; Supplier Part Number 1: YAG3045CT-ND; Category: Resistors; Supplier 1: Digi-Key
R228 = Res_0402: Manufacturer Part Number 1: RC0402FR-07750RL; Manufacturer: Yageo; Part Description: RES SMD 750 OHM 1% 1/16W 0402; Resistance (Ohms): 750; Power (Watts): 0.063W, 1/16W; Temperature Coefficient: ±100ppm/°C; Value: 750R, 1%; Tolerance: ±1%; Number of Terminations: 2; Supplier Device Package: 0402; Size / Dimension: 0.039" L x 0.020" W (1.00mm x 0.50mm); Height: 0.016" (0.40mm); Composition: Thick Film; Features: Moisture Resistant; Operating Temperature: -55°C ~ 155°C; Package / Case: 0402 (1005 Metric); Supplier 1: Digi-Key; RoHS: RoHS Compliant; Category: Resistors; Packaging: Cut Tape (CT); Supplier Part Number 1: 311-750LRCT-ND
R229 R230 R238 R240 = Res_0402: Manufacturer Part Number 1: RC0402JR-070RL; Manufacturer: Yageo; Part Description: RES SMD 0.0OHM JUMPER 1/16W 0402; Resistance (Ohms): 0.0; Tolerance: Jumper; Power (Watts): 0.063W, 1/16W; Value: 0R; Supplier 1: Digi-Key; Supplier Part Number 1: 311-0.0JRTR-ND; Category: Resistors; Temperature Coefficient: -; Features: Moisture Resistant; Supplier Device Package: 0402; Height: 0.016" (0.40mm); Package / Case: 0402 (1005 Metric); Operating Temperature: -55°C ~ 155°C; Size / Dimension: 0.039" L x 0.020" W (1.00mm x 0.50mm); Composition: Thick Film; Packaging: Tape & Reel (TR); Number of Terminations: 2; RoHS: RoHS Compliant
R231 = Res_0402: Manufacturer Part Number 1: RC0402FR-07510RL; Manufacturer: Yageo; Part Description: 510 Ohms ±1% 0.063W, 1/16W Chip Resistor 0402 (1005 Metric) Moisture Resistant Thick Film; Temperature Coefficient: ±100ppm/°C; Power (Watts): 0.063W, 1/16W; Value: 510R, 1%; Operating Temperature: -55°C ~ 155°C; Part Status: Active; Tolerance: ±1%; Packaging: Cut Tape (CT); Features: Moisture Resistant; Composition: Thick Film; Supplier Device Package: 0402; Failure Rate: -; Package / Case: 0402 (1005 Metric); Height - Seated (Max): 0.016" (0.40mm); Size / Dimension: 0.039" L x 0.020" W (1.00mm x 0.50mm); Supplier 1: Digi-Key; RoHS: RoHS Compliant; Category: Resistors; Supplier Part Number 1: 311-510LRCT-ND
R233 R234 = Res_0402: Manufacturer Part Number 1: RC0402FR-07187KL; Manufacturer: Yageo; Part Description: 187 kOhms ±1% 0.063W, 1/16W Chip Resistor 0402 (1005 Metric) Moisture Resistant Thick Film; Power (Watts): 0.063W, 1/16W; Temperature Coefficient: ±100ppm/°C; Value: 187k, 1%; Tolerance: ±1%; Height - Seated (Max): 0.016" (0.40mm); Package / Case: 0402 (1005 Metric); Supplier Device Package: 0402; Size / Dimension: 0.039" L x 0.020" W (1.00mm x 0.50mm); Category: Resistors; Composition: Thick Film; Features: Moisture Resistant; Supplier Part Number 1: 311-187KLRCT-ND; RoHS: RoHS Compliant; Part Status: Active; Supplier 1: Digi-Key; Packaging: Cut Tape (CT); Operating Temperature: -55°C ~ 155°C; Failure Rate: -
R235 R239 R241 = Res_0402: Manufacturer Part Number 1: CRCW08050000Z0EA; Manufacturer: Vishay Dale; Part Description: RES SMD 0.0 OHM JUMPER 1/8W 0805; Power (Watts): 0.125W, 1/8W; Resistance (Ohms): 0.0; Tolerance: Jumper; Value: 0R; Supplier 1: Digi-Key; Supplier Part Number 1: 541-0.0ATR-ND; Package / Case: 0805 (2012 Metric); Height: 0.020" (0.50mm); Packaging: Tape & Reel (TR); Operating Temperature: -55°C ~ 155°C; Temperature Coefficient: -; RoHS: RoHS Compliant; Size / Dimension: 0.079" L x 0.049" W (2.00mm x 1.25mm); Supplier Device Package: 0805 (2012 Metric); Number of Terminations: 2; Category: Resistors; Features: Automotive AEC-Q200; Composition: Thick Film
R236 R237 = Res_0402: Manufacturer: Yageo; Manufacturer Part Number 1: RC0402FR-0782K5L; Part Description: 82.5 kOhms ±1% 0.063W, 1/16W Chip Resistor 0402 (1005 Metric) Moisture Resistant Thick Film; Power (Watts): 0.063W, 1/16W; Temperature Coefficient: ±100ppm/°C; Value: 82.5k, 1%; RoHS: RoHS Compliant; Operating Temperature: -55°C ~ 155°C; Packaging: Cut Tape (CT); Category: Resistors; Failure Rate: -; Supplier Part Number 1: 311-82.5KLRCT-ND; Part Status: Active; Tolerance: ±1%; Features: Moisture Resistant; Supplier Device Package: 0402; Height - Seated (Max): 0.016" (0.40mm); Supplier 1: Digi-Key; Composition: Thick Film; Size / Dimension: 0.039" L x 0.020" W (1.00mm x 0.50mm); Package / Case: 0402 (1005 Metric)
T5 = NA6223-AL_Flyback_transformer: Part Description: Audio Transformers / Signal Transformers NA6223 10W 0.33Ohms For TPS23753A; Manufacturer: Coilcraft; Manufacturer Part Number 1: NA6223-ALD; Current Rating: 2A; Supplier 1: Mouser; RoHS: No; Stock 1: 2080; Pricing 1: 1 = 4,20000, 10 = 3,78000, 50 = 3,36000, 100 = 3,20000, 1000 = 2,49000, 10000 = 2,49000 (USD); REACH SVHC: Unknown; Supplier Part Number 1: 994-NA6223-ALD
VD3 = DIODE_TVS_UNIDIR: Manufacturer: Diodes Incorporated; Manufacturer Part Number 1: SMAJ58A-13-F; Part Description: TVS DIODE 58V 93.6V SMA; Current - Peak Pulse (10/1000µs): 4.3A; Power - Peak Pulse: 400W; Power Line Protection: No; Type: Zener; Voltage - Breakdown (Min): 64.4V; Voltage - Clamping (Max) @ Ipp: 93.6V; Voltage - Reverse Standoff (Typ): 58V; Applications: General Purpose; Base Part Number: SMAJ58; Capacitance @ Frequency: -; Category: Circuit Protection; Mounting Type: Surface Mount; Operating Temperature: -55°C ~ 150°C (TJ); Package / Case: DO-214AC, SMA; Packaging: Cut Tape (CT); Part Status: Active; RoHS: RoHS Compliant; Supplier 1: Digi-Key; Supplier Device Package: SMA; Supplier Part Number 1: SMAJ58A-13-FDICT-ND; Value: SMAJ58A
VD4 = DIODE_TVS_UNIDIR: SMAJ12CA-13-F; Manufacturer: ON Semiconductor; Part Description: TVS DIODE 5V 9.2V DO214AA; Voltage - Breakdown (Min): 6.4V; Type: Zener; Voltage - Clamping (Max) @ Ipp: 9.2V; Power Line Protection: No; Voltage - Reverse Standoff (Typ): 5V; Current - Peak Pulse (10/1000µs): 65.2A; Power - Peak Pulse: 600W; Category: Circuit Protection; Packaging: Cut Tape (CT); Operating Temperature: -55°C ~ 150°C (TJ); Package / Case: DO-214AA, SMB; Supplier Part Number 1: SMBJ5V0ACT-ND; Part Status: Discontinued at Digi-Key; Manufacturer Part Number 1: SMBJ5V0A; Supplier Device Package: DO-214AA (SMB); Mounting Type: Surface Mount; Supplier 1: Digi-Key; RoHS: RoHS Compliant; Base Part Number: SMBJ5V0; Applications: General Purpose; Capacitance @ Frequency: -; Value: SMBJ5V0A
VT8 = CSD17527Q5A_NMOS: Part Description: N-Channel 30V 65A (Tc) 3W (Ta) Surface Mount 8-VSONP (5x6); Manufacturer: Texas Instruments; Rise Time: 8.2ns; Rds On Max: 10.8mR; Input Capacitance: 506pF; Drain to Source Voltage (Vdss): 30V; Continuous Drain Current (ID): 65A; Max Power Dissipation: 3W; Fall Time: 3.2ns; Gate to Source Voltage (Vgs): 20V; Turn-Off Delay Time: 9.8ns; Turn-On Delay Time: 5.6ns; Number of Elements: 1; Element Configuration: Single; ComponentLink1URL: http://www.st.com/web/en/resource/technical/document/datasheet/CD00103832.pdf; ComponentLink1Description: http://www.st.com/web/en/resource/technical/document/datasheet/CD00103832.pdf; ComponentLink2URL: http://www.st.com/content/ccc/resource/technical/document/datasheet/00/75/48/c3/62/90/4a/32/CD00103832.pdf/files/CD00103832.pdf/jcr:content/translations/en.CD00103832.pdf; ComponentLink2Description: http://www.st.com/content/ccc/resource/technical/document/datasheet/00/75/48/c3/62/90/4a/32/CD00103832.pdf/files/CD00103832.pdf/jcr:content/translations/en.CD00103832.pdf; ComponentLink3URL: http://www.mouser.com/ds/2/389/CD00103832-114014.pdf; ComponentLink3Description: http://www.mouser.com/ds/2/389/CD00103832-114014.pdf; Supplier 1: Digi-Key; Manufacturer Part Number 1: CSD17527Q5A; RoHS: Yes; Stock 1: 28951; Pricing 1: 1 = 1,20000, 10 = 1,06600, 100 = 0,84280, 500 = 0,65364, 1000 = 0,51603 (USD); Mount: Surface Mount; Number of Pins: 8; Contact Plating: Tin; Min Operating Temperature: -55°C; Max Operating Temperature: 150°C; Packaging: Tape and Reel; Package Quantity: 2500; Drain to Source Breakdown Voltage: 30V; Drain to Source Resistance: 10.8mR; Power Dissipation: 3W; Radiation Hardening: No; ComponentLink4URL: http://www.ti.com/general/docs/lit/getliterature.tsp?genericPartNumber=CSD17527Q5A&&fileType=pdf; ComponentLink4Description: http://www.ti.com/general/docs/lit/getliterature.tsp?genericPartNumber=CSD17527Q5A&&fileType=pdf; ComponentLink5URL: http://www.ti.com/lit/ds/slps331a/slps331a.pdf; ComponentLink5Description: http://www.ti.com/lit/ds/slps331a/slps331a.pdf; ComponentLink6URL: http://www.ti.com/lit/ds/symlink/csd17527q5a.pdf; ComponentLink6Description: http://www.ti.com/lit/ds/symlink/csd17527q5a.pdf; ComponentLink7URL: http://www.ti.com/litv/slps331a; ComponentLink7Description: http://www.ti.com/litv/slps331a; Supplier Part Number 1: 296-29021-1-ND
VT9 = SI4848DY_NMOS: Part Description: N-Channel 150V 2.7A (Ta) 1.5W (Ta) Surface Mount 8-SO; Manufacturer: Vishay Siliconix; Manufacturer Part Number 1: SI4848DY-T1-E3; Drain to Source Voltage (Vdss): 150V; Continuous Drain Current (ID): 2.7A; Drain to Source Resistance: 85mR; Gate to Source Voltage (Vgs): 20V; Turn-Off Delay Time: 24ns; Turn-On Delay Time: 9ns; Power Dissipation: 1.5W; Nominal Vgs: 2V; Rise Time: 10ns; Number of Elements: 1; Element Configuration: Single; ComponentLink1URL: http://www.st.com/web/en/resource/technical/document/datasheet/CD00103832.pdf; ComponentLink1Description: http://www.st.com/web/en/resource/technical/document/datasheet/CD00103832.pdf; ComponentLink2URL: http://www.st.com/content/ccc/resource/technical/document/datasheet/00/75/48/c3/62/90/4a/32/CD00103832.pdf/files/CD00103832.pdf/jcr:content/translations/en.CD00103832.pdf; ComponentLink2Description: http://www.st.com/content/ccc/resource/technical/document/datasheet/00/75/48/c3/62/90/4a/32/CD00103832.pdf/files/CD00103832.pdf/jcr:content/translations/en.CD00103832.pdf; ComponentLink3URL: http://www.mouser.com/ds/2/389/CD00103832-114014.pdf; ComponentLink3Description: http://www.mouser.com/ds/2/389/CD00103832-114014.pdf; Supplier 1: Digi-Key; RoHS: Yes; Stock 1: 21882; Pricing 1: 1 = 1,69000, 10 = 1,49500, 100 = 1,18140, 500 = 0,91620, 1000 = 0,72331 (USD); Mount: Surface Mount; Case/Package: SOIC; Number of Pins: 8; Weight: 0.01787oz; Contact Plating: Matte,Tin; Min Operating Temperature: -55°C; Max Operating Temperature: 150°C; Packaging: Tape and Reel; Drain to Source Breakdown Voltage: 150V; Package Quantity: 2500; Rds On Max: 85mR; Max Power Dissipation: 1.5W; Fall Time: 10ns; Threshold Voltage: 2V; Number of Channels: 1; On-State Resistance: 85mR; Length: 5mm; Height: 1.55mm; Width: 4mm; REACH SVHC: Unknown; Lead Free: Lead Free; ComponentLink4URL: http://www.vishay.com/docs/71356/71356.pdf; ComponentLink4Description: http://www.vishay.com/docs/71356/71356.pdf; ComponentLink5URL: http://www.farnell.com/datasheets/1866379.pdf; ComponentLink5Description: http://www.farnell.com/datasheets/1866379.pdf; ComponentLink6URL: http://www.jameco.com/Jameco/Products/ProdDS/1073931.pdf; ComponentLink6Description: http://www.jameco.com/Jameco/Products/ProdDS/1073931.pdf; ComponentLink7URL: http://datasheet.iiic.cc/vishay_[siliconix]/SI4848DY-T1-E3.pdf; ComponentLink7Description: http://datasheet.iiic.cc/vishay_[siliconix]/SI4848DY-T1-E3.pdf; Supplier Part Number 1: SI4848DY-T1-E3CT-ND
VT10 = FDC86244_NMOS: Part Description: N-Channel 150V 2.3A (Ta) 1.6W (Ta) Surface Mount SuperSOT™-6; Manufacturer: ON Semiconductor / Fairchild; Rise Time: 1.4ns; Rds On Max: 144mR; Input Capacitance: 345pF; Continuous Drain Current (ID): 2.3A; Drain to Source Voltage (Vdss): 150V; Max Power Dissipation: 800mW; Drain to Source Resistance: 20mR; Power Dissipation: 1.6W; Turn-Off Delay Time: 10ns; Turn-On Delay Time: 4.7ns; Fall Time: 3.1ns; Number of Elements: 1; Threshold Voltage: 2.5V; Element Configuration: Single; Gate to Source Voltage (Vgs): 20V; ComponentLink1URL: http://www.st.com/web/en/resource/technical/document/datasheet/CD00103832.pdf; ComponentLink1Description: http://www.st.com/web/en/resource/technical/document/datasheet/CD00103832.pdf; ComponentLink2URL: http://www.st.com/content/ccc/resource/technical/document/datasheet/00/75/48/c3/62/90/4a/32/CD00103832.pdf/files/CD00103832.pdf/jcr:content/translations/en.CD00103832.pdf; ComponentLink2Description: http://www.st.com/content/ccc/resource/technical/document/datasheet/00/75/48/c3/62/90/4a/32/CD00103832.pdf/files/CD00103832.pdf/jcr:content/translations/en.CD00103832.pdf; ComponentLink3URL: http://www.mouser.com/ds/2/389/CD00103832-114014.pdf; ComponentLink3Description: http://www.mouser.com/ds/2/389/CD00103832-114014.pdf; ComponentLink4URL: http://www.ti.com/general/docs/lit/getliterature.tsp?genericPartNumber=CSD17527Q5A&&fileType=pdf; ComponentLink4Description: http://www.ti.com/general/docs/lit/getliterature.tsp?genericPartNumber=CSD17527Q5A&&fileType=pdf; ComponentLink5URL: http://www.ti.com/lit/ds/slps331a/slps331a.pdf; ComponentLink5Description: http://www.ti.com/lit/ds/slps331a/slps331a.pdf; ComponentLink6URL: http://www.ti.com/lit/ds/symlink/csd17527q5a.pdf; ComponentLink6Description: http://www.ti.com/lit/ds/symlink/csd17527q5a.pdf; ComponentLink7URL: http://www.ti.com/litv/slps331a; ComponentLink7Description: http://www.ti.com/litv/slps331a; Supplier 1: Digi-Key; Manufacturer Part Number 1: FDC86244; RoHS: Yes; Pricing 1: 1 = 1,30000, 10 = 1,15100, 100 = 0,90990, 500 = 0,70564, 1000 = 0,55709 (USD); Mount: Surface Mount; Case/Package: SOT-23-6; Number of Pins: 6; Weight: 0.036g; Contact Plating: Matte,Tin; Min Operating Temperature: -55°C; Max Operating Temperature: 150°C; Packaging: Tape and Reel; Package Quantity: 3000; Drain to Source Breakdown Voltage: 150V; Length: 3mm; Height: 1mm; Width: 1.7mm; Radiation Hardening: No; REACH SVHC: No SVHC; Lead Free: Lead Free; ComponentLink8URL: https://www.fairchildsemi.com/datasheets/FD/FDC86244.pdf; ComponentLink8Description: https://www.fairchildsemi.com/datasheets/FD/FDC86244.pdf; ComponentLink9URL: http://www.fairchildsemi.com/ds/FD/FDC86244.pdf; ComponentLink9Description: http://www.fairchildsemi.com/ds/FD/FDC86244.pdf; ComponentLink10URL: http://www.mouser.com/ds/2/149/FDC86244-92611.pdf; ComponentLink10Description: http://www.mouser.com/ds/2/149/FDC86244-92611.pdf; Supplier Part Number 1: FDC86244DKR-ND